# Altium schematic sheet Communication.SchDoc
size OrCAD A
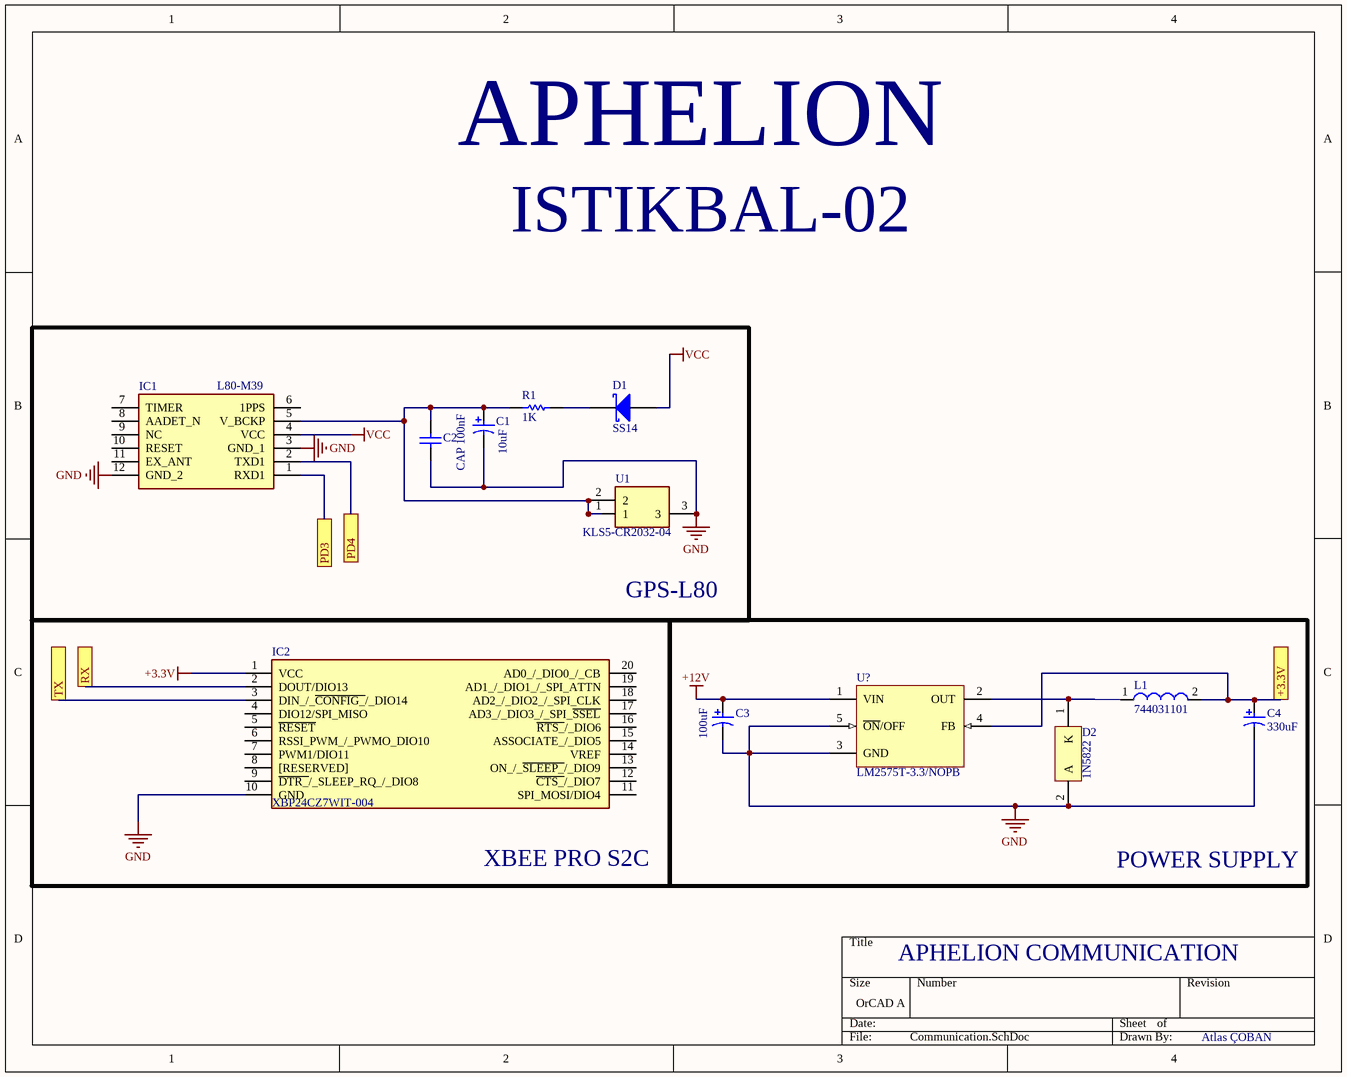
[diagram p0: Communication.SchDoc]

## Parts
C1  10uF  [CAPPR55-200-1100X500X1200]
C2  CAP 100nF  [CAPC1206(3216)190_M]
C3  100uF  [CAPPR65-350-1150X800X1250]
C4  330uF  [CAPPR80-750-2000X1800X2200]
D1  SS14  [FAIR-DO-214AC-2_V]
D2  1N5822  [ONSC-AXIAL_LEAD-2-267-05_V]
IC1  L80-M39  [L80-M39]
IC2  XBP24CZ7WIT-004  [XBP24CZ7WIT004]
L1  744031101  [WE-TPC-3816-S]
R1  1K  [RESC3216X60X45ML15T20]
U1  KLS5-CR2032-04  [KLS5CR203204]
U?  LM2575T-3.3/NOPB  [KC0005A]

## Blocks framed on the sheet
GPS-L80: C1 C2 D1 IC1 R1 U1
POWER SUPPLY: C3 C4 D2 L1 U?

## Ports
+3.3V, PD3, PD4, RX, TX

## Nets
+3.3V: IC2.1(VCC)
+12V: C3.1 U?.1(VIN)
GND: C1.2 C2.1 C3.2 C4.2 D2.2(A) IC1.3(GND_1) IC1.12(GND_2) IC2.10(GND) U1.3 U?.3(GND) U?.5(~{ON}/OFF)
VCC: D1.2(A) IC1.4(VCC)
+3.3V: C4.1 L1.2 U?.4(FB) ; port +3.3V  [a separate net that carries the same name]
PD3: IC1.1(RXD1) ; port PD3
PD4: IC1.2(TXD1) ; port PD4
RX: IC2.2(DOUT/DIO13) ; port RX
TX: IC2.3(DIN_/_~{CONFIG_}/_DIO14) ; port TX
NetC1_1: C1.1 C2.2 IC1.5(V_BCKP) R1.1 U1.1 U1.2
NetD1_1: D1.1(K) R1.2
NetD2_1: D2.1(K) L1.1 U?.2(OUT)

Not connected (* = marked no-connect by the designer): IC1 6(1PPS) 7(TIMER) 8(AADET_N) 9(NC) 10(RESET) 11(EX_ANT); IC2 4(DIO12/SPI_MISO) 5(~{RESET}) 6(RSSI_PWM_/_PWMO_DIO10) 7(PWM1/DIO11) 8([RESERVED]) 9(~{DTR_}/_SLEEP_RQ_/_DIO8) 11(SPI_MOSI/DIO4) 12(~{CTS_}/_DIO7) 13(ON_/_~{SLEEP_}/_DIO9) 14(VREF) 15(ASSOCIATE_/_DIO5) 16(~{RTS_}/_DIO6) 17(AD3_/_DIO3_/_SPI_~{SSEL}) 18(AD2_/_DIO2_/_SPI_CLK) 19(AD1_/_DIO1_/_SPI_ATTN) 20(AD0_/_DIO0_/_CB)

## Notes on the sheet
- APHELION
- ISTIKBAL-02
- (near IC2) XBEE PRO S2C
- APHELION COMMUNICATION
- Atlas ÇOBAN

## Library data of the parts
C1 = CMP-2100-03622-1: Aluminum Electrolytic Capacitor, 10 uF, +/- 20%, 50 V, -40 to 85 degC, 2-Pin THD, RoHS, Bulk; Manufacturer: Panasonic; Life (Hours): 2000Hour; Lead/Base Style: Straight; Dissipation Factor: 0.12%; Leakage Current: 3uA; Dielectric Material: Aluminium; Lead Diameter: 0.5mm; Voltage Rating: 50V; Ripple Current: 65mA; Package Reference: CAPPR55-200-1100X500X1200; Height: 11mm; Diameter: 5mm; REACH SVHC: NoSVHC; Mount: ThroughHole; Packaging: Bulk; Manufacturer URL: http://www.panasonic.com/; Capacitance: 10uF; Termination: Radial; Datasheet URL: https://industrial.panasonic.com/cdbs/www-data/pdf/RDF0000/ABA0000C1218.pdf; Lead Free: LeadFree; Height - Seated (Max): 0.472inch; Case/Package: Radial; Package Description: 2-Pin Radial Lead, Dia 5 mm, Height 12 mm; Tolerance: 20%; Datasheet Version: Rev. 05, 10/2016; Package Quantity: 200; Ripple Current (AC): 65mA; Min Operating Temperature: -40degC; RoHSCompliant: true; Number of Pins: 2; Max Operating Temperature: 85degC; Voltage: 50V; Lead Pitch: 2mm; Radiation Hardening: No; Voltage Rating (DC): 50V; Length: 11mm
C2 = CMP-1037-04189-1: CAP 100nF 25V ±5% 1206 (3216 Metric) Thickness 1.9mm SMD; Case-Metric: 3216; Case-EIA: 1206; Tolerance: Â±5%; Rated Voltage: 25 V; Technology: SMT; Max Thickness: 1.9 mm; Value: 100nF
C3 = CMP-2100-03623-1: Aluminum Electrolytic Capacitor, 100 uF, +/- 20%, 50 V, -40 to 85 degC, 2-Pin THD, RoHS, Bulk; Manufacturer: Panasonic; Lead Diameter: 0.6mm; Dielectric Material: Aluminium; Voltage Rating (DC): 50V; Ripple Current (AC): 250mA; Polarity: Polar; Leakage Current: 3uA; Life (Hours): 2000Hour; Lead/Base Style: Straight; Dissipation Factor: 0.12%; Radiation Hardening: No; Height: 11.5mm; Package Quantity: 200; Package Reference: CAPPR65-350-1150X800X1250; Min Operating Temperature: -40degC; Mount: ThroughHole; Package Description: 2-Pin Radial Lead, Dia 8 mm, Height 12.5 mm; Case/Package: Radial; Diameter: 8mm; Voltage Rating: 50V; Length: 11.5mm; REACH SVHC: NoSVHC; Height - Seated (Max): 0.492inch; Datasheet URL: https://industrial.panasonic.com/cdbs/www-data/pdf/RDF0000/ABA0000C1218.pdf; RoHSCompliant: true; Ripple Current: 250mA; Lead Free: LeadFree; Voltage: 50V; Manufacturer URL: http://www.panasonic.com/; Number of Pins: 2; Datasheet Version: Rev. 05, 10/2016; Packaging: Bulk; Termination: Radial; Max Operating Temperature: 85degC; Tolerance: 20%; Capacitance: 100uF; Lead Pitch: 3.5mm
C4 = CMP-2000-07350-1: Aluminum Electrolytic Capacitor, 330 uF, +/- 20%, 100 V, -40 to 105 degC, 2-Pin THD, RoHS, Bulk; Manufacturer: Nichicon; Capacitance: 330µF; Rated Voltage: 100V; Type: Radial; Case Size/Dimension: Ø18x20mm; Manufacturer URL: http://www.nichicon.co.jp/english/; Package Description: 2-Pin Through Hole Device, Dia 18 mm, Body Length 22 mm; Package Reference: CAPPR80-750-2000X1800X2200; Mounting Technology: ThroughHole; Datasheet Version: 08/2015; Operating Temp-Max: 105°C; Datasheet URL: http://products.nichicon.co.jp/en/pdf/XJA043/e-uhe.pdf
D1 = CMP-2000-04943-1: Schottky Rectifier, 1.1 W, -65 to 125 degC, 2-Pin SMD, RoHS, Tape and Reel; Manufacturer: Fairchild; Configuration: SINGLE; Diode Element Material: SILICON; Power Dissipation Limit-Max (W): 1.1; Additional Feature: FREEWHEELINGDIODE; Signal Diode Type: SIGNALDIODE; Number of Elements: 1; JEDEC-95 Code: DO-214AC; Rep Pk Reverse Voltage-Max (V): 40; Package Body Material: PLASTIC/EPOXY; CAGE Code: 1HBD3,07933,59621,7D893; Peak Reflow Temperature (Cel): 260; Package Shape: RECTANGULAR; Manufacturer URL: https://www.fairchildsemi.com/; JESD-97 Code: e3; Package Reference: DO-214AC-2; RoHS Compliant: YES; Package Description: 2-Pin Surface Mount Device, Body 4.375 x 2.725 mm; Technology: SCHOTTKY; Surface Mount: YES; Datasheet URL: http://www.onlinecomponents.com/datasheet/ss14.aspx?p=11369800; Terminal Form: CBEND; Package Style: SMALLOUTLINE; Number of Terminals: 2; JESD-30 Code: R-PDSO-C2; Average Forward Current-Max (A): 1; Terminal Finish: MATTETIN; Datasheet Version: Oct-13; Terminal Position: DUAL; Package URL: https://www.fairchildsemi.com/package-drawings/DO/DO214AC.pdf; Moisture Sensitivity Level: 1; Lead Free: YES
D2 = CMP-1055-00007-1: Rectifier, 2-Pin Axial_Lead, Bulk Bag; Manufacturer: On Semiconductor; IFSM Max (A): 80; Note1: 0; Configuration: Single; PartNumber: 1N5822; ComponentLink2Description: Datasheet; RoHS: FALSE; PackageDescription: 2-Pin, Axial Lead, Diameter 5.05 mm; Mounting Technology: Through Hole; PackageReference: AXIAL_LEAD-2-267-05; ComponentLink1URL: http://www.onsemi.com/; PackageVersion: Rev. G, 06/2000; ComponentLink2URL: http://www.onsemi.cn/pub_link/Collateral/1N5820-D.PDF; ComponentLink3Description: Package Specification; ComponentLink1Description: Manufacturer URL; ComponentLink3URL: http://www.onsemi.com/pub_link/Collateral/267-05.PDF; Packing: Bulk Bag; DatasheetVersion: Rev. 10
IC1 = L80-M39: Integrated Circuit; Manufacturer_Name: Quectel; Datasheet Link: http://docs-emea.rs-online.com/webdocs/147d/0900766b8147dbf2.pdf; Manufacturer_Part_Number: L80-M39; RS Part Number: 9084088; RS Price/Stock: http://uk.rs-online.com/web/p/products/9084088
IC2 = XBP24CZ7WIT-004: Integrated Circuit; Manufacturer_Name: Digi International; Datasheet Link: https://componentsearchengine.com/Datasheets/1/XBP24CZ7WIT-004.pdf; Height: 2.79mm; Manufacturer_Part_Number: XBP24CZ7WIT-004; Mouser Part Number: 888-XBP24CZ7WIT-004; Mouser Price/Stock: https://www.mouser.com/Search/Refine.aspx?Keyword=888-XBP24CZ7WIT-004; RS Part Number: 1359739; RS Price/Stock: http://uk.rs-online.com/web/p/products/1359739
L1 = CMP-0227-00344-1: SMD Shielded Tiny Power Inductor WE-TPC, L = 100 µH; Inductance: 100 ÂµH; PackageReference: WE-TPC-3816-S; ComponentLink1URL: http://www.we-online.com; DatasheetVersion: ver 6, Jan-2009; PackageVersion: 2009; ComponentLink2URL: http://www.we-online.de/katalog/media/pdf/744031101.pdf; ComponentLink1Description: Manufacturer Link; PackageDescription: SMD Inductor, 2-Leads, Body 3.8 x 3.8 mm; ComponentLink2Description: Datasheet
R1 = CMP-2100-03616-1: Chip Resistor, 1 KOhm, +/- 1%, 0.25 W, -55 to 155 degC, 1206 (3216 Metric), RoHS, Tape and Reel; Manufacturer: Vishay Semiconductor; Power Rating: 250mW; Voltage Rating (DC): 200V; Resistance: 1KOhm; Temperature Coefficient: 100ppm/degreesC; Case Code (Imperial): 1206; Length: 3.2mm; Case/Package: 1206; Contact Plating: Tin; Package Quantity: 10; Datasheet URL: http://www.farnell.com/datasheets/1720486.pdf; Mount: SurfaceMount; Package Description: 2-Pin Surface Mount Device, Body 3.15 x 1.6 mm; Package Reference: 1206.0; Max Operating Temperature: 155degC; Lead Free: LeadFree; Weight: 0.000353oz; Military Standard: Not; Max Power Dissipation: 250mW; Case Code (Metric): 3216; Number of Terminations: 2; Tolerance: 1%; Width: 0.063inch; Termination: SMD/SMT; Number of Pins: 2; Min Operating Temperature: -55degC; Height: 0.55mm; Depth: 1.6mm; RoHSCompliant: true; Composition: ThickFilm; Packaging: TapeandReel; Manufacturer URL: http://www.vishay.com/; Voltage Rating: 200V; Radiation Hardening: No; REACH SVHC: Unknown; Datasheet Version: 41061.0
U1 = KLS5-CR2032-04: Undefined or Miscellaneous; Manufacturer_Name: KLS Electronic; Datasheet Link: http://www.klsele.com/admin/product_upload/20151124101114KLS5-CR2032-04.pdf; Height: 18.13mm; Manufacturer_Part_Number: KLS5-CR2032-04
U? = CMP-0069-02027-3: SIMPLE SWITCHER® 1A Step-Down Voltage Regulator, 5-pin TO-220, Pb-Free; Manufacturer: Texas Instruments; PackageTopMarking: NSUZXYTTE#*LM2575T*-3.3 P+; PowerWise: N; PackageReference: KC0005A; PinCount: 5; CompType: Switcher; Code_JEDEC: TO-220-AB; RoHS: Y; ComponentLink1URL: http://www.ti.com/general/docs/lit/getliterature.tsp?genericPartNumber=LM2575-N&fileType=pdf; PackageDescription: TO-220, Molded, 5 Lead, Straight; ComponentLink1Description: Datasheet URL